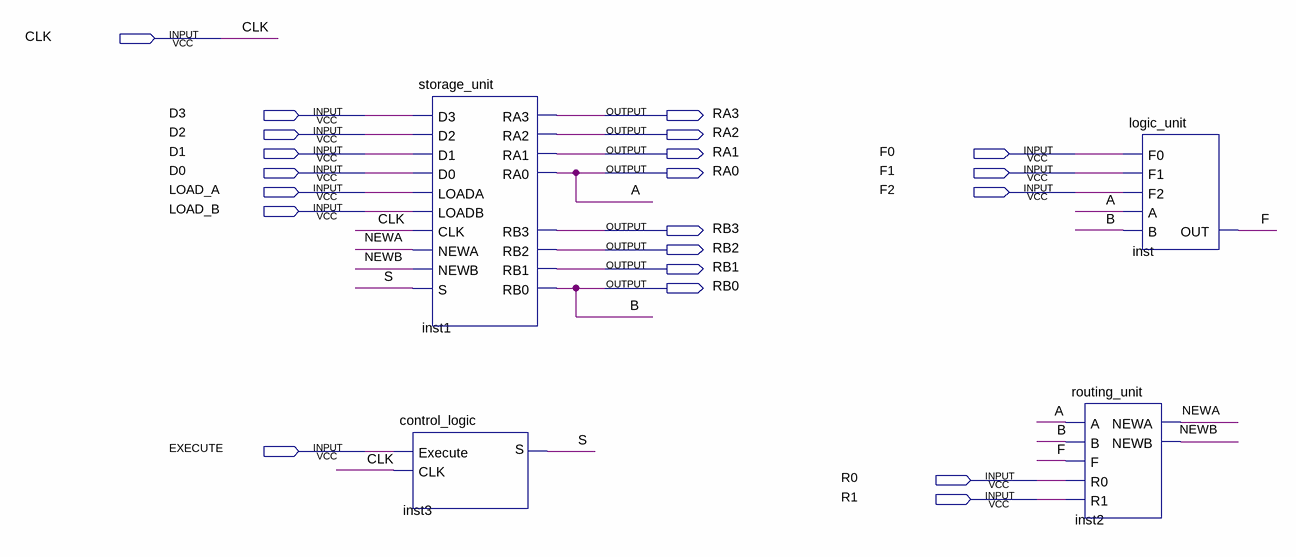
[diagram p0: schematic sheet]
// Quartus schematic lab3.bdf as structural Verilog: 4 symbols, 21 pins
module lab3 (
  input  CLK,
  input  D3,
  input  D2,
  input  D1,
  input  F0,
  input  D0,
  input  F1,
  input  LOAD_A,
  input  F2,
  input  LOAD_B,
  input  EXECUTE,
  input  R0,
  input  R1,
  output RA3,
  output RA2,
  output RA1,
  output RA0,
  output RB3,
  output RB2,
  output RB1,
  output RB0
);

  wire F, NEWA, NEWB, S;

  storage_unit inst1 (
    .D3(D3), .D2(D2), .NEWA(NEWA), .D1(D1), .D0(D0), .CLK(CLK), .LOADA(LOAD_A), .S(S), .NEWB(NEWB),
    .LOADB(LOAD_B), .RA3(RA3), .RA2(RA2), .RA1(RA1), .RA0(RA0), .RB3(RB3), .RB2(RB2), .RB1(RB1), .RB0(RB0));
  control_logic inst3 (.Execute(EXECUTE), .CLK(CLK), .S(S));
  logic_unit inst (.F0(F0), .F1(F1), .F2(F2), .A(RA0), .B(RB0), .OUT(F));
  routing_unit inst2 (.A(RA0), .B(RB0), .F(F), .R0(R0), .R1(R1), .NEWA(NEWA), .NEWB(NEWB));

  // Other names for the same wires on the sheet: A = RA0; B = RB0
endmodule
